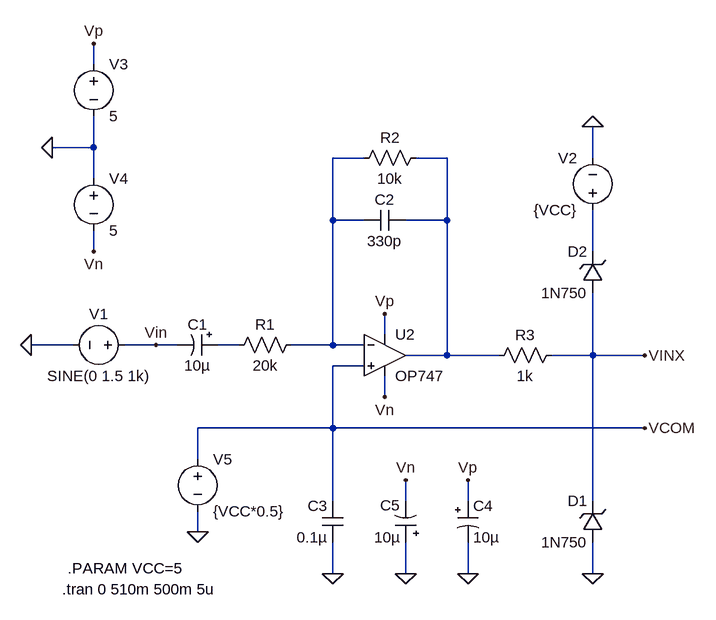
[diagram p0: schematic Example of Vcom-biased buffering for 2-Vrms input with overvoltage protection.asc]
Example of Vcom-biased buffering for 2-Vrms input with overvoltage protection.asc, the LTspice schematic file:
Version 4
SHEET 1 880 680
WIRE -464 -336 -464 -368
WIRE -464 -208 -464 -256
WIRE -464 -208 -528 -208
WIRE -48 -192 -96 -192
WIRE 80 -192 32 -192
WIRE 304 -192 304 -240
WIRE -464 -160 -464 -208
WIRE -96 -96 -96 -192
WIRE -48 -96 -96 -96
WIRE 80 -96 80 -192
WIRE 80 -96 16 -96
WIRE -464 -48 -464 -80
WIRE 304 -48 304 -112
WIRE -16 80 -16 48
WIRE -496 96 -560 96
WIRE -368 96 -416 96
WIRE -336 96 -368 96
WIRE -240 96 -272 96
WIRE -96 96 -96 -96
WIRE -96 96 -160 96
WIRE -48 96 -96 96
WIRE 80 112 80 -96
WIRE 80 112 16 112
WIRE 160 112 80 112
WIRE 304 112 304 16
WIRE 304 112 240 112
WIRE 384 112 304 112
WIRE -48 128 -96 128
WIRE -16 176 -16 144
WIRE -96 224 -96 128
WIRE -96 224 -304 224
WIRE 384 224 -96 224
WIRE -304 272 -304 224
WIRE -96 336 -96 224
WIRE 16 336 16 304
WIRE 112 336 112 304
WIRE 304 336 304 112
WIRE -304 384 -304 352
WIRE -96 448 -96 400
WIRE 16 448 16 400
WIRE 112 448 112 400
WIRE 304 448 304 400
FLAG -96 448 0
FLAG 304 448 0
FLAG 16 448 0
FLAG 112 448 0
FLAG 384 224 VCOM
FLAG 384 112 VINX
FLAG -16 48 Vp
FLAG -16 176 Vn
FLAG 16 304 Vn
FLAG 112 304 Vp
FLAG 304 -240 0
FLAG -368 96 Vin
FLAG -528 -208 0
FLAG -464 -368 Vp
FLAG -464 -48 Vn
FLAG -560 96 0
FLAG -304 384 0
SYMBOL cap 16 -112 R90
WINDOW 0 0 32 VBottom 2
WINDOW 3 32 32 VTop 2
SYMATTR InstName C2
SYMATTR Value 330p
SYMBOL cap -80 400 R180
WINDOW 0 24 56 Left 2
WINDOW 3 24 8 Left 2
SYMATTR InstName C3
SYMATTR Value 0.1µ
SYMBOL res -144 80 R90
WINDOW 0 0 56 VBottom 2
WINDOW 3 32 56 VTop 2
SYMATTR InstName R1
SYMATTR Value 20k
SYMBOL res 48 -208 R90
WINDOW 0 0 56 VBottom 2
WINDOW 3 32 56 VTop 2
SYMATTR InstName R2
SYMATTR Value 10k
SYMBOL res 256 96 R90
WINDOW 0 0 56 VBottom 2
WINDOW 3 32 56 VTop 2
SYMATTR InstName R3
SYMATTR Value 1k
SYMBOL polcap 96 336 R0
SYMATTR InstName C4
SYMATTR Value 10µ
SYMBOL polcap 32 400 R180
WINDOW 0 24 57 Left 2
WINDOW 3 24 8 Left 2
SYMATTR InstName C5
SYMATTR Value 10µ
SYMBOL voltage -400 96 R90
WINDOW 0 -32 56 VBottom 2
WINDOW 3 32 56 VTop 2
WINDOW 123 0 0 Left 0
WINDOW 39 0 0 Left 0
SYMATTR InstName V1
SYMATTR Value SINE(0 1.5 1k)
SYMBOL polcap -272 80 R90
WINDOW 0 0 32 VBottom 2
WINDOW 3 32 32 VTop 2
SYMATTR InstName C1
SYMATTR Value 10µ
SYMBOL zener 320 400 R180
WINDOW 0 24 64 Left 2
WINDOW 3 24 0 Left 2
SYMATTR InstName D1
SYMATTR Value 1N750
SYMBOL zener 320 16 R180
WINDOW 0 24 64 Left 2
WINDOW 3 24 0 Left 2
SYMATTR InstName D2
SYMATTR Value 1N750
SYMBOL voltage 304 -96 R180
WINDOW 0 24 96 Left 2
WINDOW 3 24 16 Left 2
SYMATTR InstName V2
SYMATTR Value {VCC}
SYMBOL voltage -464 -352 R0
SYMATTR InstName V3
SYMATTR Value 5
SYMBOL voltage -464 -176 R0
SYMATTR InstName V4
SYMATTR Value 5
SYMBOL voltage -304 256 R0
WINDOW 123 0 0 Left 0
WINDOW 39 0 0 Left 0
SYMATTR InstName V5
SYMATTR Value {VCC*0.5}
SYMBOL OpAmps\\OP747 -16 48 R0
SYMATTR InstName U2
TEXT -512 472 Left 2 !.tran 0 510m 500m 5u
TEXT -504 440 Left 2 !.PARAM VCC=5

The netlist it stands for:
* Example of Vcom-biased buffering for 2-Vrms input with overvoltage protection.asc
C2 N002 N001 330p
C3 0 VCOM 0.1µ
R1 N001 N004 20k
R2 N002 N001 10k
R3 VINX N002 1k
C4 Vp 0 10µ
C5 0 Vn 10µ
V1 Vin 0 SINE(0 1.5 1k)
C1 N004 Vin 10µ
D1 0 VINX 1N750
D2 VINX N003 1N750
V2 N003 0 {VCC}
V3 Vp 0 5
V4 0 Vn 5
V5 VCOM 0 {VCC*0.5}
XU2 VCOM N001 Vp Vn N002 OP747  ; pins In+ In- V+ V- OUT
.model D D
.lib standard.dio
.tran 0 510m 500m 5u
.PARAM VCC=5
.backanno
.end